# EAGLE schematic nrings (EAGLE 7.5.0)

## Sheet 1 of 5: Sheet1
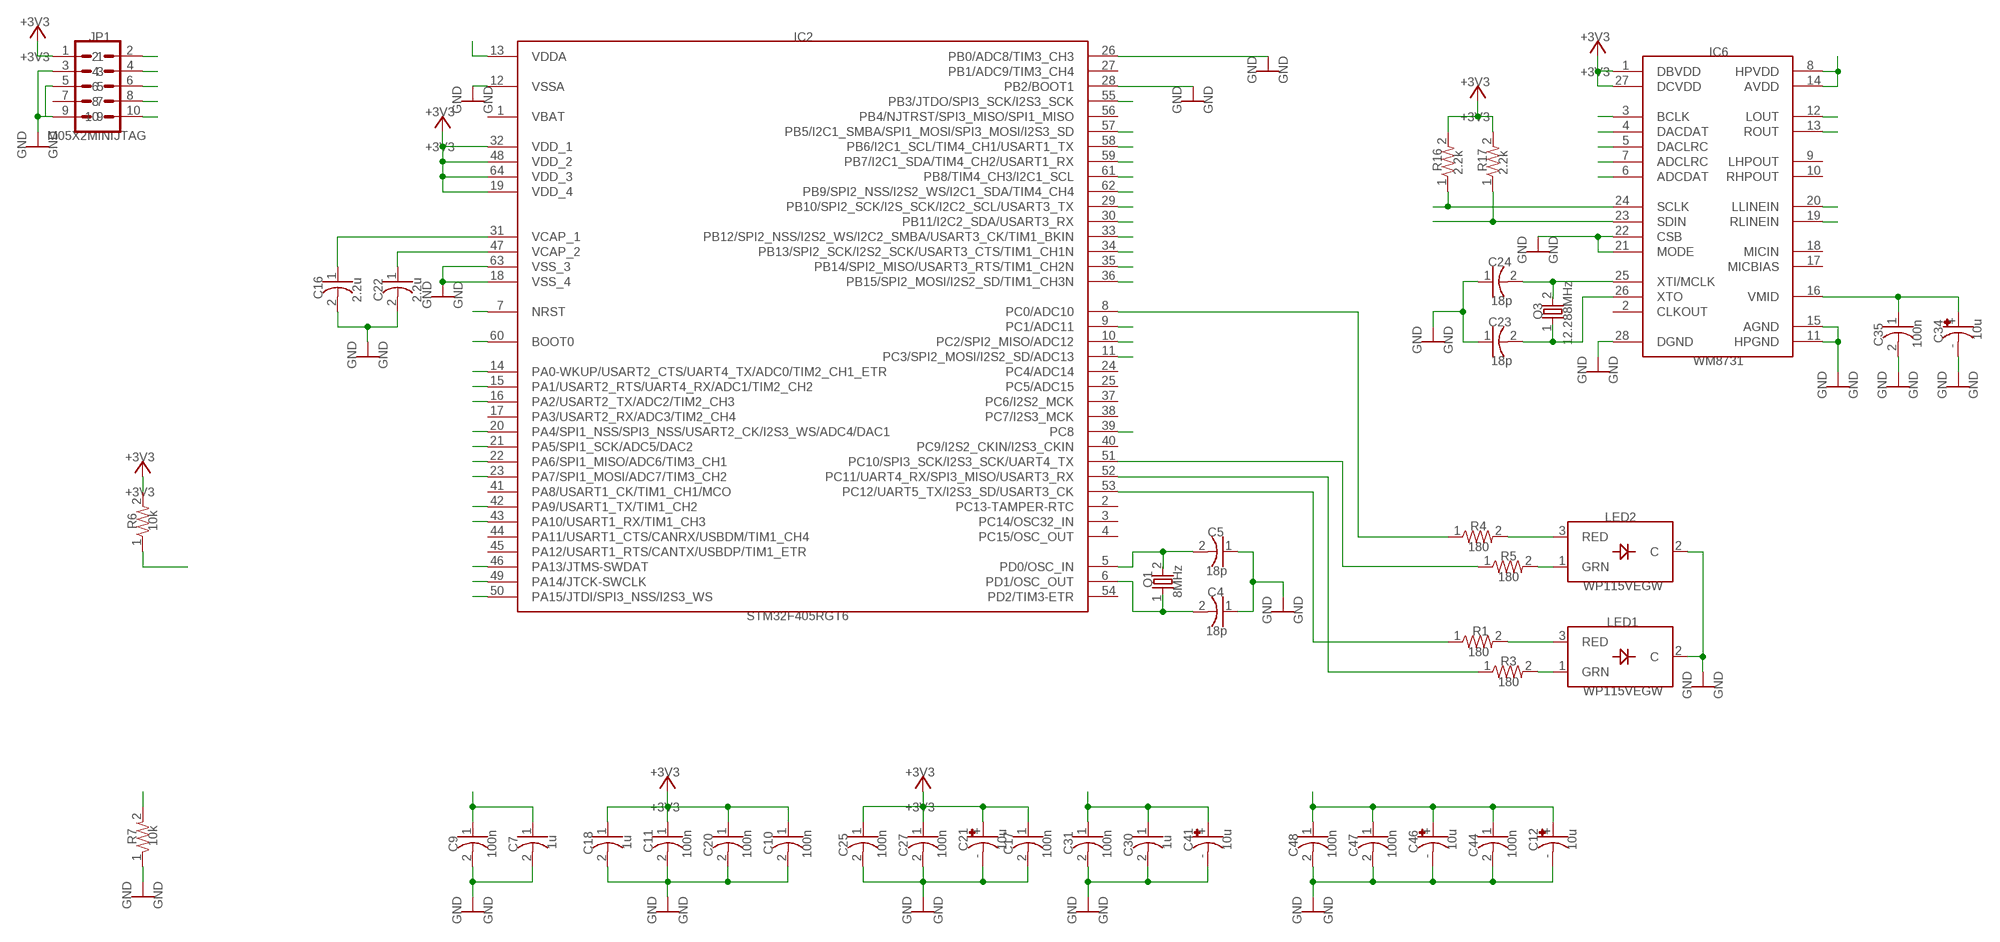
[diagram p0: schematic, sheet 1]

### Parts
C4  18p  C-USC0603  [CAP_0603]
C5  18p  C-USC0603  [CAP_0603]
C7  1u  C-USC0603_4  [CAP_0603]
C9  100n  C-USC0603_4  [CAP_0603]
C10  100n  C-USC0603_4  [CAP_0603]
C11  100n  C-USC0603_4  [CAP_0603]
C12  10u  CPOL-USA  [PANASONIC_A]
C16  2.2u  C-USC0805  [CAP_0805]
C17  100n  C-USC0603_4  [CAP_0603]
C18  1u  C-USC0603_4  [CAP_0603]
C20  100n  C-USC0603_4  [CAP_0603]
C21  10u  CPOL-USA  [PANASONIC_A]
C22  2.2u  C-USC0805  [CAP_0805]
C23  18p  C-USC0603_5  [CAP_0603]
C24  18p  C-USC0603_5  [CAP_0603]
C25  100n  C-USC0603_4  [CAP_0603]
C27  100n  C-USC0603_4  [CAP_0603]
C30  1u  C-USC0603_4  [CAP_0603]
C31  100n  C-USC0603_4  [CAP_0603]
C34  10u  CPOL-USA  [PANASONIC_A]
C35  100n  C-USC0603_4  [CAP_0603]
C41  10u  CPOL-USA  [PANASONIC_A]
C44  100n  C-USC0603_4  [CAP_0603]
C46  10u  CPOL-USA  [PANASONIC_A]
C47  100n  C-USC0603_4  [CAP_0603]
C48  100n  C-USC0603_4  [CAP_0603]
IC2  STM32F405RGT6  STM32F20X  [TQFP-10X10-64]
IC6  WM8731  [SSOP28]
JP1  M05X2MINIJTAG  [2X5-1.27]
LED1  WP115VEGW  LED-BICOLOR-THROUGHHOLE  [LED-BICOLOR-THROUGHHOLE]
LED2  WP115VEGW  LED-BICOLOR-THROUGHHOLE  [LED-BICOLOR-THROUGHHOLE]
Q1  8MHz  TSC_7A_CRYSTAL  [TSC_7A_CRYSTAL]
Q3  12.288MHz  TSC_7A_CRYSTAL_17  [TSC_7A_CRYSTAL]
R1  180  R-US_R0603  [RES_0603]
R3  180  R-US_R0603  [RES_0603]
R4  180  R-US_R0603  [RES_0603]
R5  180  R-US_R0603  [RES_0603]
R6  10k  R-US_R0603_34  [RES_0603]
R7  10k  R-US_R0603_35  [RES_0603]
R16  2.2k  R-US_R0603_34  [RES_0603]
R17  2.2k  R-US_R0603_34  [RES_0603]

### Nets
+3V3: C10.1 C11.1 C17.1 C18.1 C20.1 C21.+ C25.1 C27.1 IC2.19(VDD_4) IC2.32(VDD_1) IC2.48(VDD_2) IC2.64(VDD_3) IC6.1(DBVDD) IC6.27(DCVDD) JP1.1 R6.2 R16.2 R17.2 ; also sheet 4,5
+3V3_A: C7.1 C9.1 C12.+ C30.1 C31.1 C41.+ C44.1 C46.+ C47.1 C48.1 IC2.13(VDDA) IC6.8(HPVDD) IC6.14(AVDD) ; also sheet 2,3,5
AUX_OUT: IC6.13(ROUT) ; also sheet 4
BOOT_FLASH: IC2.60(BOOT0) R7.2
BRIGHTNESS_CV: IC2.14(PA0-WKUP/USART2_CTS/UART4_TX/ADC0/TIM2_CH1_ETR) ; also sheet 3
DAMP_CV: IC2.21(PA5/SPI1_SCK/ADC5/DAC2) ; also sheet 3
FM_CV: IC2.20(PA4/SPI1_NSS/SPI3_NSS/USART2_CK/I2S3_WS/ADC4/DAC1) ; also sheet 3
FREQUENCY_POT: IC2.11(PC3/SPI2_MOSI/I2S2_SD/ADC13) ; also sheet 2
GEOMETRY_CV: IC2.22(PA6/SPI1_MISO/ADC6/TIM3_CH1) ; also sheet 3
GEOMETRY_POT: IC2.10(PC2/SPI2_MISO/ADC12) ; also sheet 2
GND: C4.1 C5.1 C7.2 C9.2 C10.2 C11.2 C12.- C16.2 C17.2 C18.2 C20.2 C21.- C22.2 C23.1 C24.1 C25.2 C27.2 C30.2 C31.2 C34.- C35.2 C41.- C44.2 C46.- C47.2 C48.2 IC2.12(VSSA) IC2.18(VSS_4) IC2.26(PB0/ADC8/TIM3_CH3) IC2.28(PB2/BOOT1) IC2.63(VSS_3) IC6.11(HPGND) IC6.15(AGND) IC6.21(MODE) IC6.22(CSB) IC6.28(DGND) JP1.3 JP1.5 JP1.9 LED1.2(C) LED2.2(C) R7.1 ; also sheet 2,3,4,5
I2C_SCL: IC2.29(PB10/SPI2_SCK/I2S_SCK/I2C2_SCL/USART3_TX) IC6.24(SCLK) R16.1
I2C_SDA: IC2.30(PB11/I2C2_SDA/USART3_RX) IC6.23(SDIN) R17.1
I2S_LRCK: IC2.33(PB12/SPI2_NSS/I2S2_WS/I2C2_SMBA/USART3_CK/TIM1_BKIN) IC6.5(DACLRC) IC6.7(ADCLRC)
I2S_SCK: IC2.34(PB13/SPI2_SCK/I2S2_SCK/USART3_CTS/TIM1_CH1N) IC6.3(BCLK)
I2S_SIN: IC2.35(PB14/SPI2_MISO/USART3_RTS/TIM1_CH2N) IC6.6(ADCDAT)
I2S_SOUT: IC2.36(PB15/SPI2_MOSI/I2S2_SD/TIM1_CH3N) IC6.4(DACDAT)
IN_1: IC6.20(LLINEIN) ; also sheet 4
IN_2: IC6.19(RLINEIN) ; also sheet 4
JTCK: IC2.49(PA14/JTCK-SWCLK) JP1.4
JTDI: IC2.50(PA15/JTDI/SPI3_NSS/I2S3_WS) JP1.8
JTDO: IC2.55(PB3/JTDO/SPI3_SCK/I2S3_SCK) JP1.6
JTMS: IC2.46(PA13/JTMS-SWDAT) JP1.2
MAIN_OUT: IC6.12(LOUT) ; also sheet 4
MUX_ADDR_0: IC2.59(PB7/I2C1_SDA/TIM4_CH2/USART1_RX) ; also sheet 2
MUX_ADDR_1: IC2.58(PB6/I2C1_SCL/TIM4_CH1/USART1_TX) ; also sheet 2
MUX_ADDR_2: IC2.57(PB5/I2C1_SMBA/SPI1_MOSI/SPI3_MOSI/I2S3_SD) ; also sheet 2
MUXED_POTS: IC2.9(PC1/ADC11) ; also sheet 2
N$7: C5.2 IC2.5(PD0/OSC_IN) Q1.2
N$8: C4.2 IC2.6(PD1/OSC_OUT) Q1.1
N$12: LED1.3(RED) R1.2
N$13: C22.1 IC2.47(VCAP_2)
N$17: C34.+ C35.1 IC6.16(VMID)
N$19: C16.1 IC2.31(VCAP_1)
N$22: LED1.1(GRN) R3.2
N$27: LED2.3(RED) R4.2
N$35: LED2.1(GRN) R5.2
N$37: IC2.52(PC11/UART4_RX/SPI3_MISO/USART3_RX) R3.1
N$40: IC2.8(PC0/ADC10) R4.1
N$41: C24.2 IC6.25(XTI/MCLK) Q3.2
N$42: C23.2 IC6.26(XTO) Q3.1
N$43: IC2.53(PC12/UART5_TX/I2S3_SD/USART3_CK) R1.1
N$44: IC2.51(PC10/SPI3_SCK/I2S3_SCK/UART4_TX) R5.1
NORMALIZATION_PROBE: IC2.39(PC8) ; also sheet 4
POSITION_CV: IC2.23(PA7/SPI1_MOSI/ADC7/TIM3_CH2) ; also sheet 3
RESET: IC2.7(NRST) JP1.10 R6.1
RX: IC2.43(PA10/USART1_RX/TIM1_CH3)
STRUM: IC2.16(PA2/USART2_TX/ADC2/TIM2_CH3) ; also sheet 4
SW_MODE: IC2.61(PB8/TIM4_CH3/I2C1_SCL) ; also sheet 2
SW_POLYPHONY: IC2.62(PB9/SPI2_NSS/I2S2_WS/I2C1_SDA/TIM4_CH4) ; also sheet 2
TX: IC2.42(PA9/USART1_TX/TIM1_CH2)
V_OCT_CV: IC2.15(PA1/USART2_RTS/UART4_RX/ADC1/TIM2_CH2) ; also sheet 3
Unconnected: IC2.2(PC13-TAMPER-RTC) IC2.3(PC14/OSC32_IN) IC2.4(PC15/OSC_OUT) IC2.17(PA3/USART2_RX/ADC3/TIM2_CH4) IC2.24(PC4/ADC14) IC2.25(PC5/ADC15) IC2.27(PB1/ADC9/TIM3_CH4) IC2.37(PC6/I2S2_MCK) IC2.38(PC7/I2S3_MCK) IC2.40(PC9/I2S2_CKIN/I2S3_CKIN) IC2.41(PA8/USART1_CK/TIM1_CH1/MCO) IC2.44(PA11/USART1_CTS/CANRX/USBDM/TIM1_CH4) IC2.45(PA12/USART1_RTS/CANTX/USBDP/TIM1_ETR) IC2.54(PD2/TIM3-ETR) IC2.56(PB4/NJTRST/SPI3_MISO/SPI1_MISO) IC6.2(CLKOUT) IC6.9(LHPOUT) IC6.10(RHPOUT) IC6.17(MICBIAS) IC6.18(MICIN) JP1.7

### Notes on the sheet
- +3V3
- JP1 | IC2 | +3V3
- +3V3
- IC6
- +3V3
- GND | GND | +3V3
- GND | GND | GND | GND | +3V3
- +3V3
- M05X2MINIJTAG
- +3V3
- GND | GND
- R16 | 2.2k | R17 | 2.2k
- C24 | GND | GND
- C16 | 18p
- 2.2u | C22 | 2.2u
- GND | GND
- Q3
- C23
- C34 | 10u
- 12.288MHz | C35 | 100n
- GND | GND | 18p | WM8731
- GND | GND
- GND | GND
- GND | GND | GND | GND | GND | GND
- +3V3
- +3V3
- LED2
- R6 | 10k | R4
- C5
- 180
- R5
- 18p
- 180
- WP115VEGW
- Q1
- 8MHz | C4
- STM32F405RGT6
- 18p | GND | GND | LED1
- R1
- 180
- R3
- 180
- WP115VEGW
- GND | GND
- +3V3 | +3V3
- +3V3 | +3V3
- R7 | 10k
- C9 | C7 | 1u | 1u | C11 | C21 | 10u | 1u | C41 | 10u | 10u | C12 | 10u
- C18 | C20 | C10 | C25 | C27 | C17 | C31 | C30 | C46
- 100n | 100n | 100n | 100n | 100n | 100n | 100n | 100n | C48 | 100n | C47 | 100n | C44 | 100n
- GND | GND
- GND | GND | GND | GND | GND | GND | GND | GND | GND | GND

## Sheet 2 of 5: Sheet2
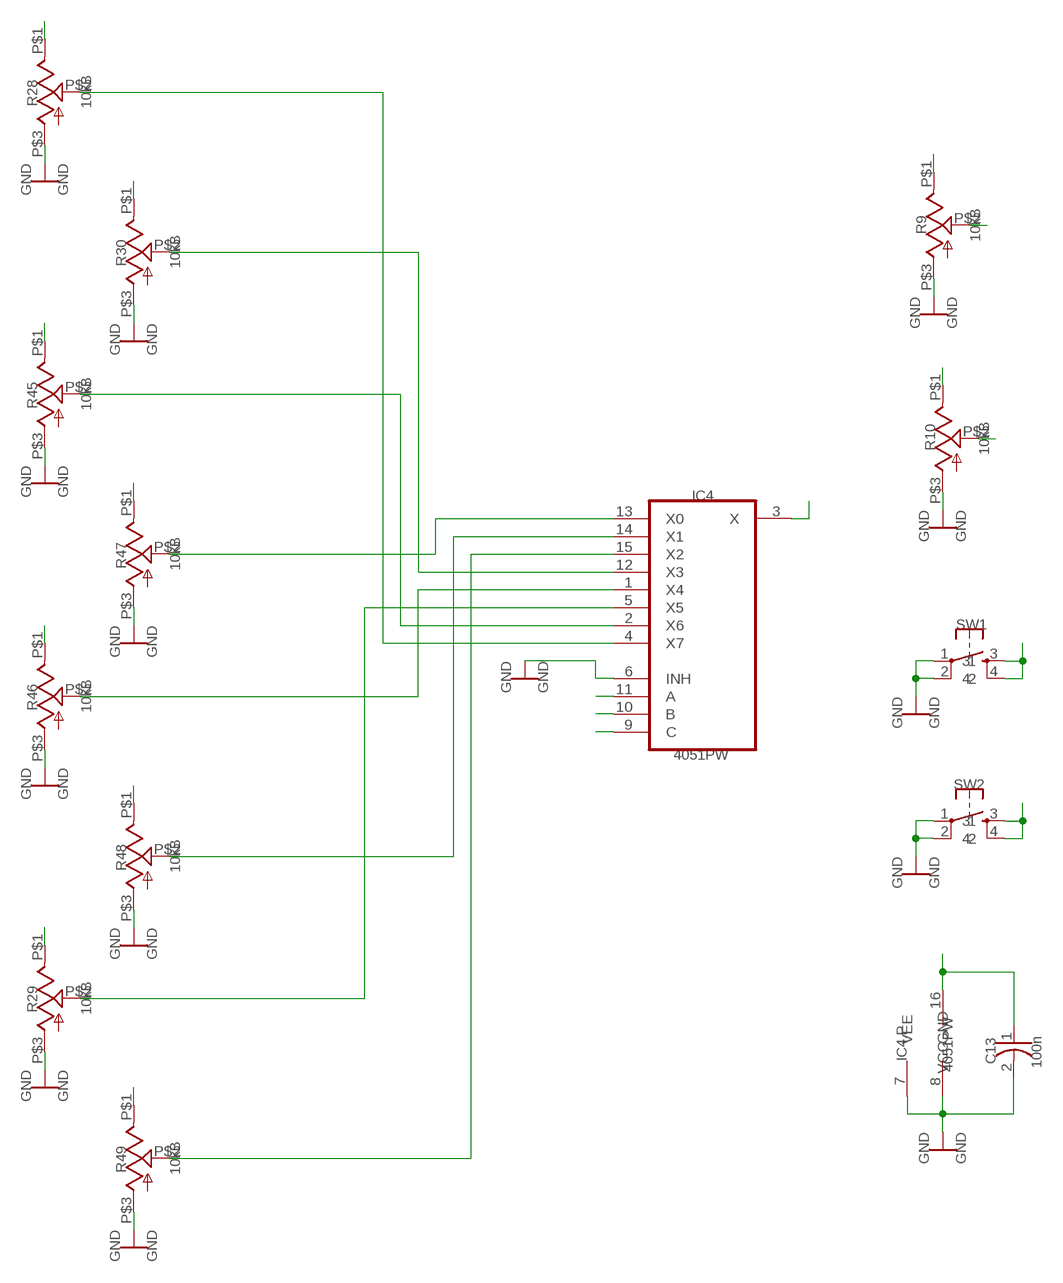
[diagram p1: schematic, sheet 2]

### Parts
C13  100n  C-USC0603_4  [CAP_0603]
IC4  4051PW  [TSSOP16]
R9  10kB  POT_USVERTICAL_PS  [ALPS_POT_VERTICAL_PS]
R10  10kB  POT_USVERTICAL_PS  [ALPS_POT_VERTICAL_PS]
R28  10kB  POT_USVERTICAL_PS  [ALPS_POT_VERTICAL_PS]
R29  10kB  POT_USVERTICAL_PS  [ALPS_POT_VERTICAL_PS]
R30  10kB  POT_USVERTICAL_PS  [ALPS_POT_VERTICAL_PS]
R45  10kB  POT_USVERTICAL  [ALPS_POT_VERTICAL]
R46  10kB  POT_USVERTICAL  [ALPS_POT_VERTICAL]
R47  10kB  POT_USVERTICAL  [ALPS_POT_VERTICAL]
R48  10kB  POT_USVERTICAL  [ALPS_POT_VERTICAL]
R49  10kB  POT_USVERTICAL  [ALPS_POT_VERTICAL]
SW1  TAC_SWITCHPTH  [TACTILE-PTH]
SW2  TAC_SWITCHPTH  [TACTILE-PTH]

### Nets
+3V3_A: C13.1 IC4.16(PART_P:VCC) R9.P$1(E) R10.P$1(E) R28.P$1(E) R29.P$1(E) R30.P$1(E) R45.P$1(E) R46.P$1(E) R47.P$1(E) R48.P$1(E) R49.P$1(E) ; also sheet 1,3,5
BRIGHTNESS_ATT: IC4.2(PART_1:X6) R45.P$2(S)
BRIGHTNESS_POT: IC4.4(PART_1:X7) R28.P$2(S)
DAMP_ATT: IC4.13(PART_1:X0) R47.P$2(S)
DAMP_POT: IC4.5(PART_1:X5) R29.P$2(S)
FREQUENCY_ATT: IC4.1(PART_1:X4) R46.P$2(S)
FREQUENCY_POT: R9.P$2(S) ; also sheet 1
GEOMETRY_ATT: IC4.14(PART_1:X1) R48.P$2(S)
GEOMETRY_POT: R10.P$2(S) ; also sheet 1
GND: C13.2 IC4.6(PART_1:INH) IC4.7(PART_P:VEE) IC4.8(PART_P:GND) R9.P$3(A) R10.P$3(A) R28.P$3(A) R29.P$3(A) R30.P$3(A) R45.P$3(A) R46.P$3(A) R47.P$3(A) R48.P$3(A) R49.P$3(A) SW1.1 SW1.2 SW2.1 SW2.2 ; also sheet 1,3,4,5
MUX_ADDR_0: IC4.11(PART_1:A) ; also sheet 1
MUX_ADDR_1: IC4.10(PART_1:B) ; also sheet 1
MUX_ADDR_2: IC4.9(PART_1:C) ; also sheet 1
MUXED_POTS: IC4.3(PART_1:X) ; also sheet 1
POSITION_ATT: IC4.15(PART_1:X2) R49.P$2(S)
POSITION_POT: IC4.12(PART_1:X3) R30.P$2(S)
SW_MODE: SW2.3 SW2.4 ; also sheet 1
SW_POLYPHONY: SW1.3 SW1.4 ; also sheet 1

### Notes on the sheet
- R28 | 10kB
- GND | GND
- R9
- 10kB
- R30 | 10kB
- GND | GND
- GND | GND
- R45 | 10kB
- R10
- 10kB
- GND | GND | IC4
- GND | GND
- R47 | 10kB
- SW1
- GND | GND
- GND | GND
- R46 | 10kB
- GND | GND
- 4051PW
- SW2
- GND | GND
- R48 | 10kB
- GND | GND
- GND | GND
- R29 | 10kB
- IC4.P | C13
- 4051PW | 100n
- GND | GND
- GND | GND
- R49 | 10kB
- GND | GND

## Sheet 3 of 5: Sheet3
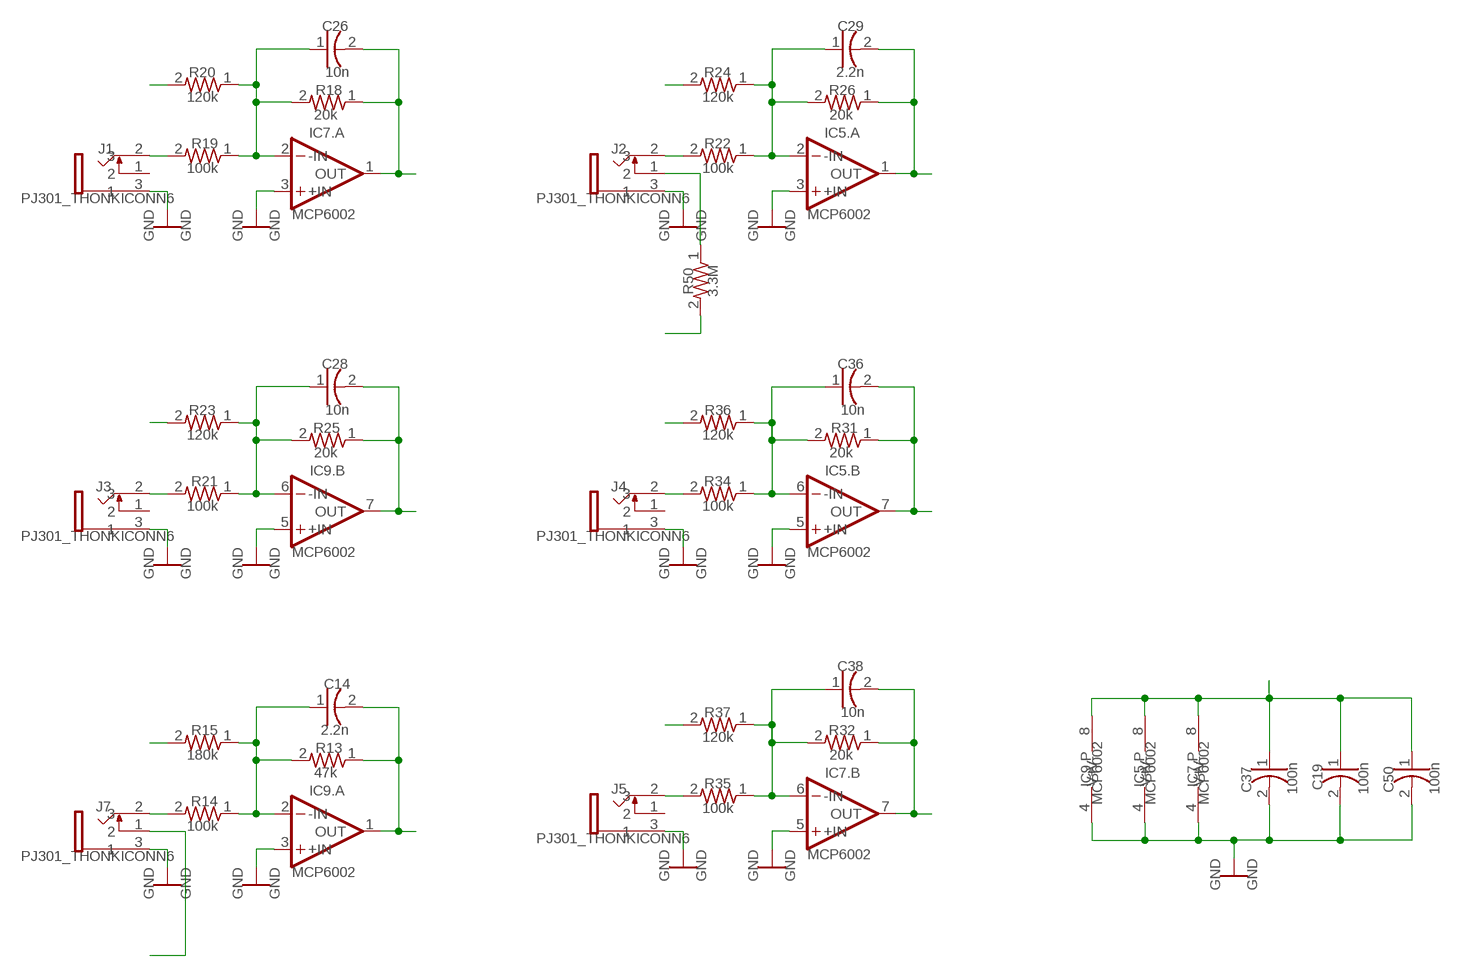
[diagram p2: schematic, sheet 3]

### Parts
C14  2.2n  C-USC0603_5  [CAP_0603]
C19  100n  C-USC0603_4  [CAP_0603]
C26  10n  C-USC0603_5  [CAP_0603]
C28  10n  C-USC0603_5  [CAP_0603]
C29  2.2n  C-USC0603_5  [CAP_0603]
C36  10n  C-USC0603_5  [CAP_0603]
C37  100n  C-USC0603_4  [CAP_0603]
C38  10n  C-USC0603_5  [CAP_0603]
C50  100n  C-USC0603_4  [CAP_0603]
IC5  MCP6002  TL072D  [SO08]
IC7  MCP6002  TL072D  [SO08]
IC9  MCP6002  TL072D  [SO08]
J1  PJ301_THONKICONN6  BRIGHT  [THONKICONN]
J2  PJ301_THONKICONN6  [THONKICONN]
J3  PJ301_THONKICONN6  DAMP  [THONKICONN]
J4  PJ301_THONKICONN6  GEOM  [THONKICONN]
J5  PJ301_THONKICONN6  POS  [THONKICONN]
J7  PJ301_THONKICONN6  VOCT  [THONKICONN]
R13  47k  R-US_R0603_37  [RES_0603]
R14  100k  R-US_R0603_37  [RES_0603]
R15  180k  R-US_R0603_37  [RES_0603]
R18  20k  R-US_R0603_37  [RES_0603]
R19  100k  R-US_R0603_37  [RES_0603]
R20  120k  R-US_R0603_37  [RES_0603]
R21  100k  R-US_R0603_37  [RES_0603]
R22  100k  R-US_R0603_37  [RES_0603]
R23  120k  R-US_R0603_37  [RES_0603]
R24  120k  R-US_R0603_37  [RES_0603]
R25  20k  R-US_R0603_37  [RES_0603]
R26  20k  R-US_R0603_37  [RES_0603]
R31  20k  R-US_R0603_37  [RES_0603]
R32  20k  R-US_R0603_37  [RES_0603]
R34  100k  R-US_R0603_37  [RES_0603]
R35  100k  R-US_R0603_37  [RES_0603]
R36  120k  R-US_R0603_37  [RES_0603]
R37  120k  R-US_R0603_37  [RES_0603]
R50  3.3M  R-US_R0603_36  [RES_0603]

### Nets
+3V3_A: C19.1 C37.1 C50.1 IC5.8(PART_P:V+) IC7.8(PART_P:V+) IC9.8(PART_P:V+) R50.2 ; also sheet 1,2,5
AREF_-10: R15.2 R20.2 R23.2 R24.2 R36.2 R37.2 ; also sheet 5
BRIGHTNESS_CV: C26.2 IC7.1(PART_A:OUT) R18.1 ; also sheet 1
CV_NORMALIZATION: J7.1 ; also sheet 4
DAMP_CV: C28.2 IC9.7(PART_B:OUT) R25.1 ; also sheet 1
FM_CV: C29.2 IC5.1(PART_A:OUT) R26.1 ; also sheet 1
GEOMETRY_CV: C36.2 IC5.7(PART_B:OUT) R31.1 ; also sheet 1
GND: C19.2 C37.2 C50.2 IC5.3(PART_A:+IN) IC5.4(PART_P:V-) IC5.5(PART_B:+IN) IC7.3(PART_A:+IN) IC7.4(PART_P:V-) IC7.5(PART_B:+IN) IC9.3(PART_A:+IN) IC9.4(PART_P:V-) IC9.5(PART_B:+IN) J1.3 J2.3 J3.3 J4.3 J5.3 J7.3 ; also sheet 1,2,4,5
N$1: J1.2 R19.2
N$2: C26.1 IC7.2(PART_A:-IN) R18.2 R19.1 R20.1
N$3: J7.2 R14.2
N$4: J2.2 R22.2
N$5: C29.1 IC5.2(PART_A:-IN) R22.1 R24.1 R26.2
N$6: J4.2 R34.2
N$10: J3.2 R21.2
N$11: C28.1 IC9.6(PART_B:-IN) R21.1 R23.1 R25.2
N$14: C14.1 IC9.2(PART_A:-IN) R13.2 R14.1 R15.1
N$15: C36.1 IC5.6(PART_B:-IN) R31.2 R34.1 R36.1
N$26: J5.2 R35.2
N$30: C38.1 IC7.6(PART_B:-IN) R32.2 R35.1 R37.1
N$38: J2.1 R50.1
POSITION_CV: C38.2 IC7.7(PART_B:OUT) R32.1 ; also sheet 1
V_OCT_CV: C14.2 IC9.1(PART_A:OUT) R13.1 ; also sheet 1
Unconnected: J1.1 J3.1 J4.1 J5.1

### Notes on the sheet
- C26 | C29
- 10n | 2.2n
- R20 | R24
- 120k | R18 | 120k | R26
- 20k | 20k
- IC7.A | IC5.A
- R19 | R22
- J1 | J2
- 100k | 100k
- PJ301_THONKICONN6 | PJ301_THONKICONN6
- MCP6002 | MCP6002
- GND | GND | GND | GND | GND | GND | GND | GND
- R50 | 3.3M
- C28 | C36
- 10n | 10n
- R23 | R36
- 120k | R25 | 120k | R31
- 20k | 20k
- IC9.B | IC5.B
- R21 | R34
- J3 | J4
- 100k | 100k
- PJ301_THONKICONN6 | PJ301_THONKICONN6
- MCP6002 | MCP6002
- GND | GND | GND | GND | GND | GND | GND | GND
- C38
- C14
- 10n
- R37
- 2.2n
- R15 | 120k | R32
- 180k | R13 | 20k
- 47k
- IC7.B
- R35 | IC9.P | IC5.P | IC7.P | C19
- IC9.A | J5 | C37 | 100n | 100n | C50 | 100n
- R14 | 100k | MCP6002 | MCP6002 | MCP6002
- J7
- 100k
- PJ301_THONKICONN6
- PJ301_THONKICONN6 | MCP6002
- MCP6002
- GND | GND | GND | GND
- GND | GND
- GND | GND | GND | GND

## Sheet 4 of 5: Sheet4
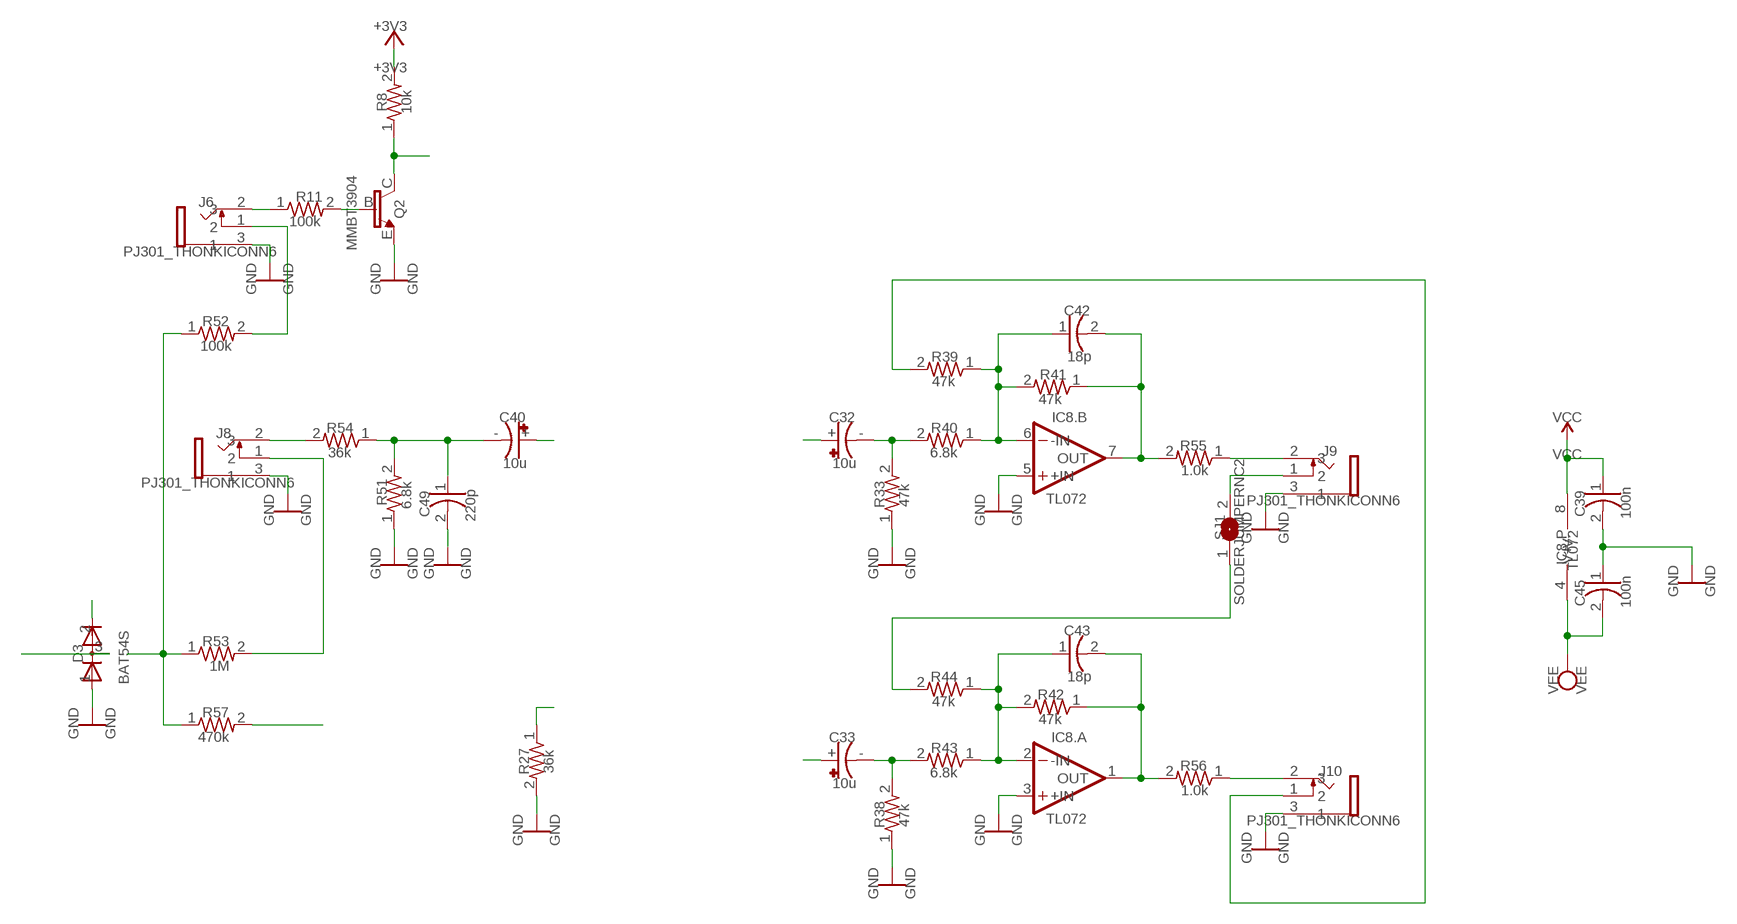
[diagram p3: schematic, sheet 4]

### Parts
C32  10u  CPOL-USA_29  [PANASONIC_A]
C33  10u  CPOL-USA_29  [PANASONIC_A]
C39  100n  C-USC0603_4  [CAP_0603]
C40  10u  CPOL-USA_30  [PANASONIC_A]
C42  18p  C-USC0603_5  [CAP_0603]
C43  18p  C-USC0603_5  [CAP_0603]
C45  100n  C-USC0603_4  [CAP_0603]
C49  220p  C-USC0603_4  [CAP_0603]
D3  BAT54S  DIODE_2CACA-SOT23  [SOT23]
IC8  TL072  TL072D  [SO08]
J6  PJ301_THONKICONN6  STRUM  [THONKICONN]
J8  PJ301_THONKICONN6  IN  [THONKICONN]
J9  PJ301_THONKICONN6  ODD  [THONKICONN]
J10  PJ301_THONKICONN6  EVEN  [THONKICONN]
Q2  MMBT3904  MMBT3904LT1-NPN-SOT23-BEC  [SOT23-BEC]
R8  10k  R-US_R0603_34  [RES_0603]
R11  100k  R-US_R0603  [RES_0603]
R27  36k  R-US_R0603_36  [RES_0603]
R33  47k  R-US_R0603_34  [RES_0603]
R38  47k  R-US_R0603_34  [RES_0603]
R39  47k  R-US_R0603_37  [RES_0603]
R40  6.8k  R-US_R0603_37  [RES_0603]
R41  47k  R-US_R0603_37  [RES_0603]
R42  47k  R-US_R0603_37  [RES_0603]
R43  6.8k  R-US_R0603_37  [RES_0603]
R44  47k  R-US_R0603_37  [RES_0603]
R51  6.8k  R-US_R0603_34  [RES_0603]
R52  100k  R-US_R0603  [RES_0603]
R53  1M  R-US_R0603  [RES_0603]
R54  36k  R-US_R0603_37  [RES_0603]
R55  1.0k  R-US_R0603_37  [RES_0603]
R56  1.0k  R-US_R0603_37  [RES_0603]
R57  470k  R-US_R0603  [RES_0603]
SJ1  SOLDERJUMPERNC2  [SJ_2S-NOTRACE]

### Nets
+3V3: D3.2(C) R8.2 ; also sheet 1,5
AUX_OUT: C33.+ ; also sheet 1
CV_NORMALIZATION: R57.2 ; also sheet 3
GND: C39.2 C45.1 C49.2 D3.1(A) IC8.3(PART_A:+IN) IC8.5(PART_B:+IN) J6.3 J8.3 J9.3 J10.3 Q2.E R27.2 R33.1 R38.1 R51.1 ; also sheet 1,2,3,5
IN_1: R27.1 ; also sheet 1
IN_2: C40.+ ; also sheet 1
MAIN_OUT: C32.+ ; also sheet 1
N$9: J6.2 R11.1
N$18: C40.- C49.1 R51.2 R54.1
N$20: J6.1 R52.2
N$21: J8.2 R54.2
N$23: C33.- R38.2 R43.2
N$25: C43.1 IC8.2(PART_A:-IN) R42.2 R43.1 R44.1
N$28: C43.2 IC8.1(PART_A:OUT) R42.1 R56.2
N$29: J10.2 R56.1
N$31: C32.- R33.2 R40.2
N$32: C42.1 IC8.6(PART_B:-IN) R39.1 R40.1 R41.2
N$33: C42.2 IC8.7(PART_B:OUT) R41.1 R55.2
N$34: J9.2 R55.1
N$39: J8.1 R53.2
N$45: J10.1 R39.2
N$46: R44.2 SJ1.1
N$47: J9.1 SJ1.2
N$66: Q2.B R11.2
NORMALIZATION_PROBE: D3.3(AC) R52.1 R53.1 R57.1 ; also sheet 1
STRUM: Q2.C R8.1 ; also sheet 1
VCC: C39.1 IC8.8(PART_P:V+) ; also sheet 5
VEE: C45.2 IC8.4(PART_P:V-) ; also sheet 5

### Notes on the sheet
- +3V3
- +3V3
- R8 | 10k
- R11
- J6
- 100k | Q2
- PJ301_THONKICONN6 | MMBT3904
- GND | GND | GND | GND
- C42
- R52
- 100k
- 18p
- R39
- 47k | R41
- 47k
- C40 | C32 | IC8.B | VCC
- R54 | R40
- J8
- 36k | 6.8k | R55 | VCC
- 10u | 10u | J9
- 1.0k
- PJ301_THONKICONN6
- TL072 | PJ301_THONKICONN6
- R51 | 6.8k | R33 | 47k
- C49 | C39 | 100n
- 220p
- GND | GND | GND | GND
- SJ1 | GND | GND
- IC8.P
- TL072
- GND | GND | GND | GND | GND | GND
- GND | GND
- SOLDERJUMPERNC2 | C45 | 100n
- C43
- R53
- D3 | 1M
- 18p
- BAT54S | R44
- 47k | VEE | VEE
- R42
- R57 | 47k
- 470k
- GND | GND | C33 | IC8.A
- R43
- 6.8k | R56
- R27 | 36k | J10
- 10u
- 1.0k
- TL072 | PJ301_THONKICONN6
- R38 | 47k
- GND | GND | GND | GND
- GND | GND
- GND | GND

## Sheet 5 of 5: Sheet5
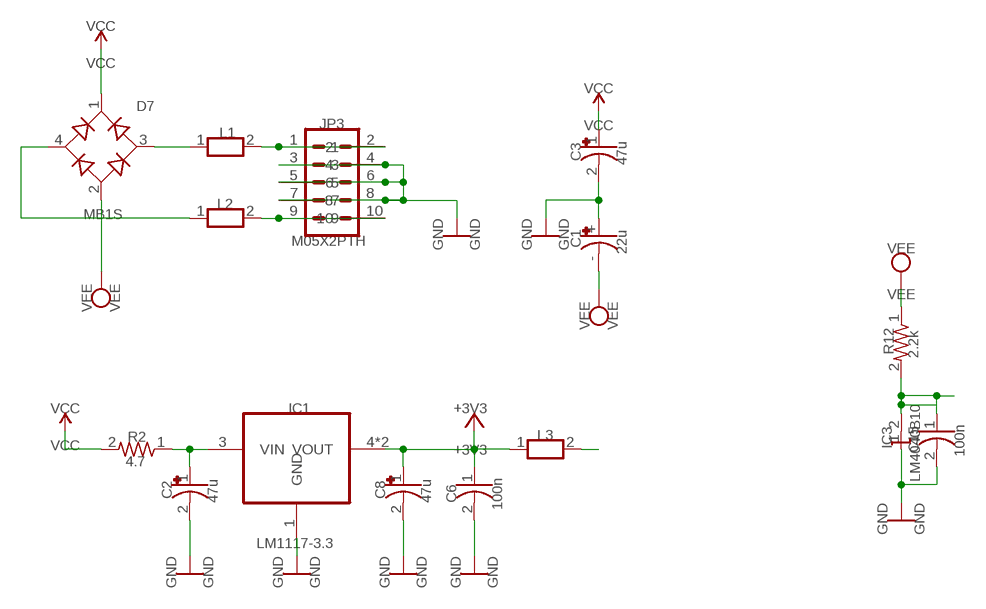
[diagram p4: schematic, sheet 5]

### Parts
C1  22u  CPOL-USC  [PANASONIC_C]
C2  47u  CPOL-USD  [CAPAE-5.3X5.3H7]
C3  47u  CPOL-USD  [CAPAE-5.3X5.3H7]
C6  100n  C-USC0603_4  [CAP_0603]
C8  47u  CPOL-USD  [CAPAE-5.3X5.3H7]
C15  100n  C-USC0603_4  [CAP_0603]
D7  MB1S  [SOP-4/6.5X2.54]
IC1  LM1117-3.3  REG1117T  [SOT223-4]
IC3  LM4040B10  LM4041B12DBZ  [DBZ_R-PDSO-G3]
JP3  M05X2PTH  [AVR_ICSP]
L1  WE-CBF_0603  [0603]
L2  WE-CBF_0603  [0603]
L3  WE-CBF_0603  [0603]
R2  4.7  R-US_R1206  [R1206]
R12  2.2k  R-US_R0603_36  [RES_0603]

### Nets
+3V3: C6.1 C8.1(+) IC1.2(VOUT) IC1.4(VOUT) L3.1 ; also sheet 1,4
+3V3_A: L3.2 ; also sheet 1,2,3
AREF_-10: C15.1 IC3.2(A) R12.2 ; also sheet 3
GND: C1.+ C2.2(-) C3.2(-) C6.2 C8.2(-) C15.2 IC1.1(GND) IC3.1(C) JP3.3 JP3.4 JP3.5 JP3.6 JP3.7 JP3.8 ; also sheet 1,2,3,4
N$16: C2.1(+) IC1.3(VIN) R2.1
N$56: JP3.1 JP3.2 L1.2
N$64: JP3.9 JP3.10 L2.2
Net_95: D7.3(AC2) L1.1
Net_96: D7.4(AC1) L2.1
VCC: C3.1(+) D7.1(+) R2.2 ; also sheet 4
VEE: C1.- D7.2(-) R12.1 ; also sheet 4

### Notes on the sheet
- VCC
- VCC
- VCC
- D7
- VCC
- JP3
- L1
- C3
- 47u
- MB1S | L2
- M05X2PTH
- GND | GND | GND | GND | C1
- 22u | VEE
- VEE
- VEE | VEE
- VEE | VEE
- R12 | 2.2k
- VCC | IC1 | +3V3
- VCC | R2 | L3
- +3V3 | IC3
- 4.7 | C15
- 100n
- LM4040B10
- C2 | C8 | C6
- 47u | 47u
- 100n
- LM1117-3.3 | GND | GND
- GND | GND | GND | GND | GND | GND | GND | GND

## Power pins joined to a net without a drawn wire
VBAT: IC2.1(VBAT)

## Library data of the parts
C1 = common:CPOL-USC
C2 C3 C8 = common:CPOL-USD
C4 C5 = common:C-USC0603
C6 C9-C11 C13 C15 C17 C19 C20 C25 C27 C31 C35 C37 C39 C44 C45 C47 C48 C50 = common:C-USC0603_4
C7 C18 C30 C49 = common:C-USC0603_4; VALUE: 100n
C12 C21 C34 C41 C46 = common:CPOL-USA
C14 C29 = common:C-USC0603_5
C16 C22 = common:C-USC0805
C23 C24 C26 C28 C36 C38 C42 C43 = common:C-USC0603_5; VALUE: 2.2n
C32 C33 = common:CPOL-USA_29
C40 = common:CPOL-USA_30
D3 = common:DIODE_2CACA-SOT23
D7 = common:MB1S
IC1 = common:REG1117T
IC2 = common:STM32F20X
IC3 = common:LM4041B12DBZ
IC4 = common:4051PW
IC5 IC7 IC9 = common:TL072D
IC6 = common:WM8731
IC8 = common:TL072D; VALUE: MCP6002
J1 = common:BRIGHT
J2 = common:PJ301_THONKICONN6
J3 = common:DAMP
J4 = common:GEOM
J5 = common:POS
J6 = common:STRUM
J7 = common:VOCT
J8 = common:IN
J9 = common:ODD
J10 = common:EVEN
JP1 = common:M05X2MINIJTAG
JP3 = common:M05X2PTH
L1-L3 = common:WE-CBF_0603
LED1 LED2 = common:LED-BICOLOR-THROUGHHOLE
Q1 = common:TSC_7A_CRYSTAL
Q2 = common:MMBT3904LT1-NPN-SOT23-BEC
Q3 = common:TSC_7A_CRYSTAL_17
R1 R3-R5 = common:R-US_R0603
R2 = common:R-US_R1206
R6 R8 = common:R-US_R0603_34
R7 = common:R-US_R0603_35
R9 R10 R28-R30 = common:POT_USVERTICAL_PS
R11 R52 R53 R57 = common:R-US_R0603; VALUE: 180
R12 = common:R-US_R0603_36
R13 R39 R41 R42 R44 = common:R-US_R0603_37
R14 R15 R18-R26 R31 R32 R34-R37 R40 R43 R54-R56 = common:R-US_R0603_37; VALUE: 47k
R16 R17 R33 R38 R51 = common:R-US_R0603_34; VALUE: 10k
R27 R50 = common:R-US_R0603_36; VALUE: 2.2k
R45-R49 = common:POT_USVERTICAL
SJ1 = common:SOLDERJUMPERNC2
SW1 SW2 = common:TAC_SWITCHPTH